# Altium project ethercat32.PrjPcb (part 2 of 3)

## Sheet DRV8300_CONTROLS.SchDoc
size B
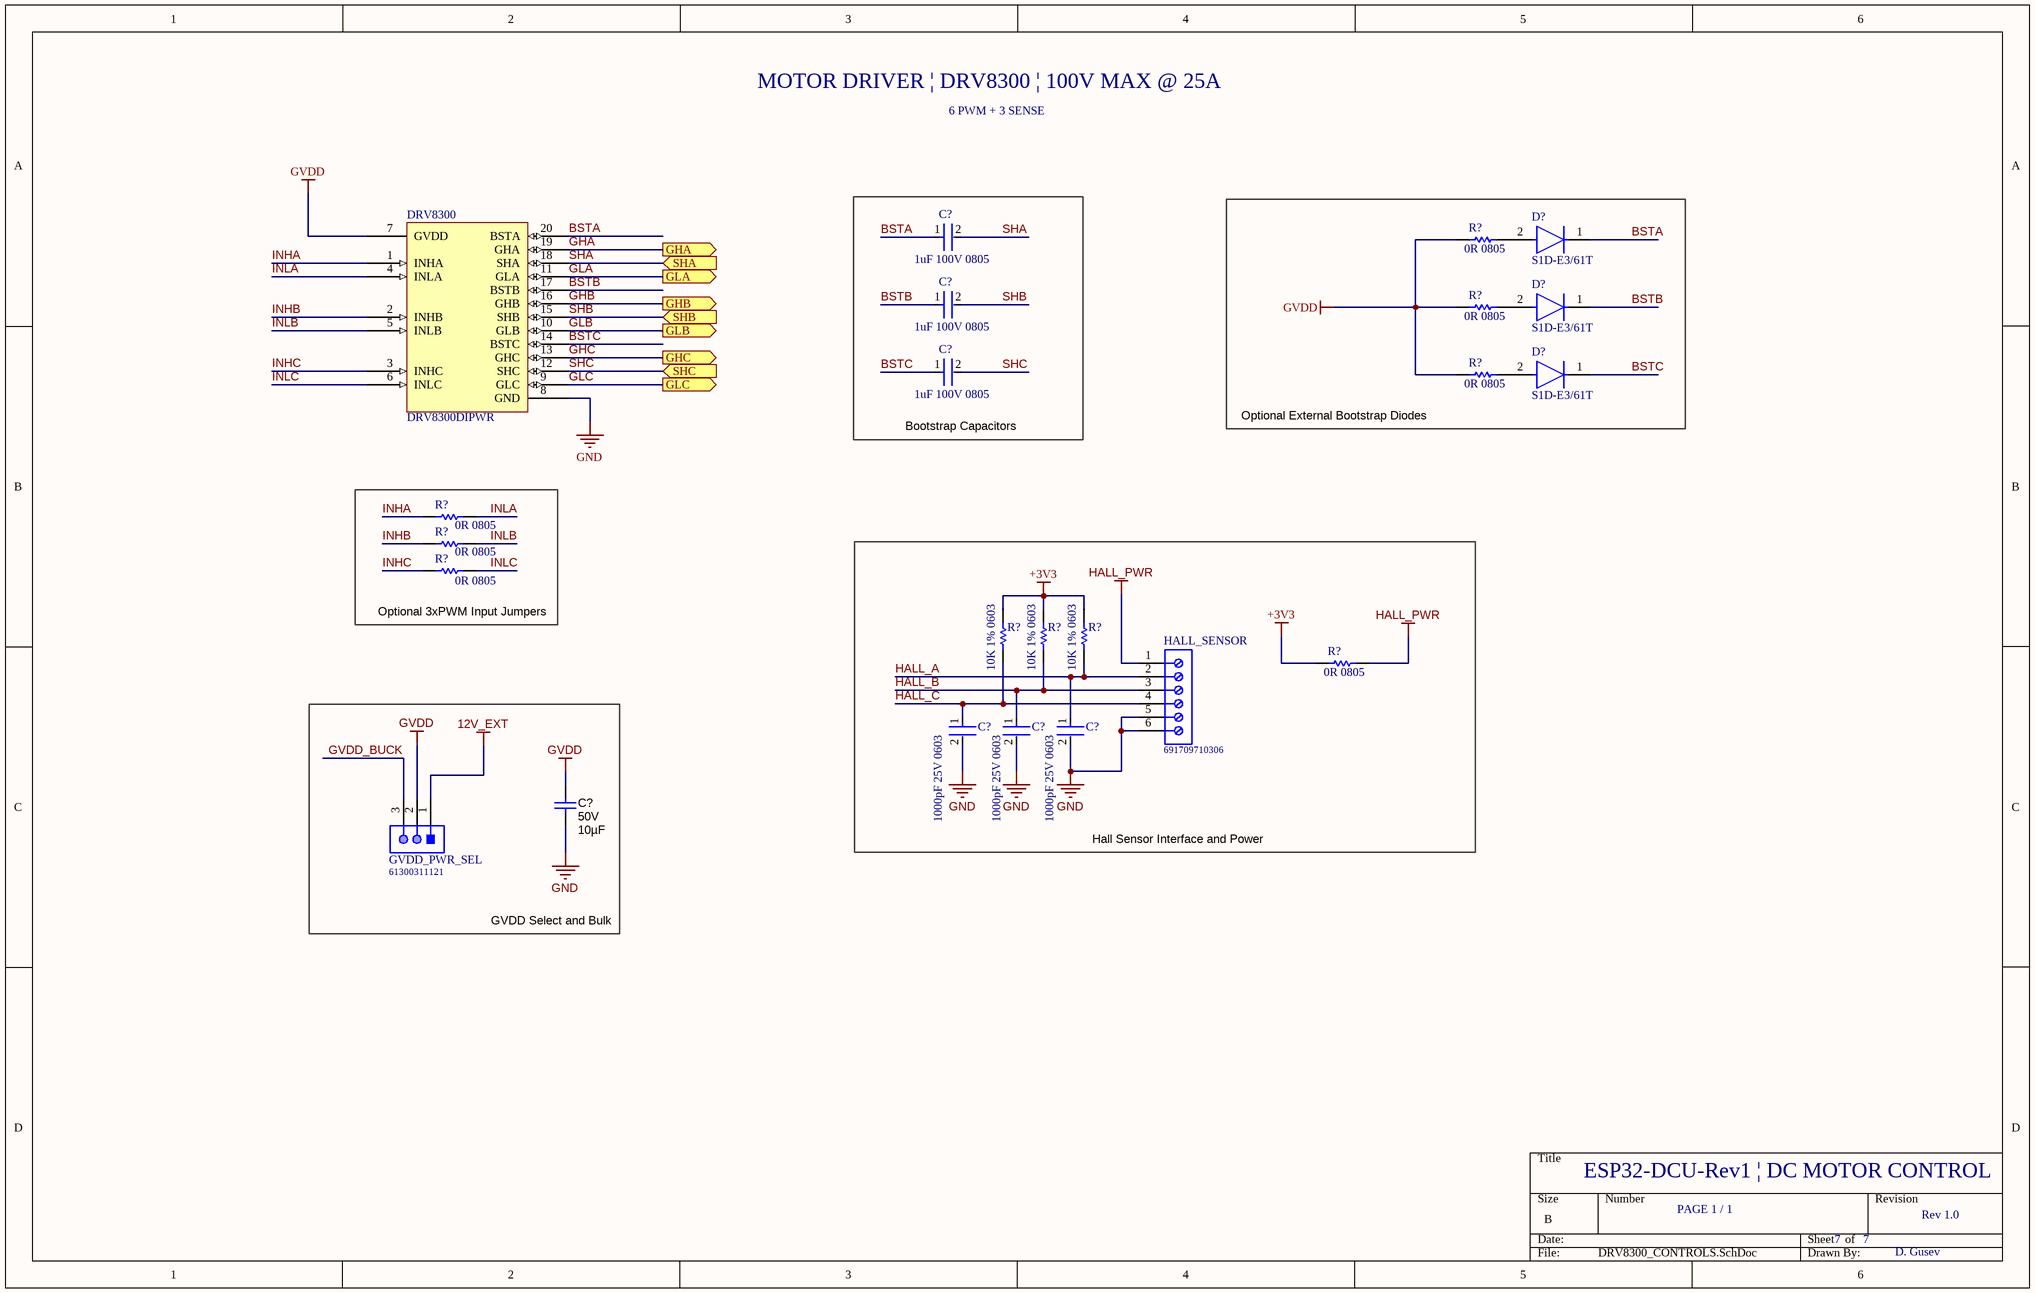
[diagram p5: DRV8300_CONTROLS.SchDoc]

### Parts
(Parts that share a designator on the sheet are numbered #1, #2 ... from top to bottom, then left to right.)
C?#1  1uF 100V 0805  [FP-C2012-125-0_2-IPC_A]
C?#2  1uF 100V 0805  [FP-C2012-125-0_2-IPC_A]
C?#3  1uF 100V 0805  [FP-C2012-125-0_2-IPC_A]
C?#4  1000pF 25V 0603  [FP-CC0201-BA-MFG]
C?#5  1000pF 25V 0603  [FP-CC0201-BA-MFG]
C?#6  1000pF 25V 0603  [FP-CC0201-BA-MFG]
C?#7  VDC_V: 50V  ValueDisplayed: 10µF  [1210_270L]  (hidden comment: CL32B106KBJNNWE)
D?#1  S1D-E3/61T  [FP-95400-MFG]
D?#2  S1D-E3/61T  [FP-95400-MFG]
D?#3  S1D-E3/61T  [FP-95400-MFG]
DRV8300  DRV8300DIPWR  [TSSOP_0DIPWR_TEX]
GVDD_PWR_SEL  61300311121  [61300311121]
HALL_SENSOR  691709710306  [691709710306]
R?#1  0R 0805  [RESC2013X60X35ML10T20]
R?#2  0R 0805  [RESC2013X60X35ML10T20]
R?#3  0R 0805  [RESC2013X60X35ML10T20]
R?#4  0R 0805  [RESC2013X60X35ML10T20]
R?#5  0R 0805  [RESC2013X60X35ML10T20]
R?#6  0R 0805  [RESC2013X60X35ML10T20]
R?#7  10K 1% 0603  [RESC2013X70X40ML20T20]
R?#8  10K 1% 0603  [RESC2013X70X40ML20T20]
R?#9  10K 1% 0603  [RESC2013X70X40ML20T20]
R?#10  0R 0805  [RESC2013X60X35ML10T20]

### Blocks framed on the sheet
Bootstrap Capacitors: C?#1-C?#3
Optional External Bootstrap Diodes: D?#1-D?#3 R?#1-R?#3
Optional 3xPWM Input Jumpers: R?#4-R?#6
Hall Sensor Interface and Power: C?#4-C?#6 HALL_SENSOR R?#7-R?#10
GVDD Select and Bulk: C?#7 GVDD_PWR_SEL

### Ports
GHA (out), GHB (out), GHC (out), GLA (out), GLB (out), GLC (out), SHA (in), SHB (in), SHC (in)

### Nets
12V_EXT: GVDD_PWR_SEL.1
+3V3: R?#7.1 R?#8.1 R?#9.1 R?#10.1
GND: C?#4.2 C?#5.2 C?#6.2 C?#7.2 DRV8300.8(GND) HALL_SENSOR.5 HALL_SENSOR.6
GVDD: C?#7.1 DRV8300.7(GVDD) GVDD_PWR_SEL.2 R?#1.1 R?#2.1 R?#3.1
HALL_PWR: HALL_SENSOR.1 R?#10.2
BSTA: C?#1.1 D?#1.1(C) DRV8300.20(BSTA)
BSTB: C?#2.1 D?#2.1(C) DRV8300.17(BSTB)
BSTC: C?#3.1 D?#3.1(C) DRV8300.14(BSTC)
GHA: DRV8300.19(GHA) ; port GHA
GHB: DRV8300.16(GHB) ; port GHB
GHC: DRV8300.13(GHC) ; port GHC
GLA: DRV8300.11(GLA) ; port GLA
GLB: DRV8300.10(GLB) ; port GLB
GLC: DRV8300.9(GLC) ; port GLC
GVDD_BUCK: GVDD_PWR_SEL.3
HALL_A: C?#6.1 HALL_SENSOR.2 R?#9.2
HALL_B: C?#5.1 HALL_SENSOR.3 R?#8.2
HALL_C: C?#4.1 HALL_SENSOR.4 R?#7.2
INHA: DRV8300.1(INHA) R?#4.1
INHB: DRV8300.2(INHB) R?#5.1
INHC: DRV8300.3(INHC) R?#6.1
INLA: DRV8300.4(INLA) R?#4.2
INLB: DRV8300.5(INLB) R?#5.2
INLC: DRV8300.6(INLC) R?#6.2
SHA: C?#1.2 DRV8300.18(SHA) ; port SHA
SHB: C?#2.2 DRV8300.15(SHB) ; port SHB
SHC: C?#3.2 DRV8300.12(SHC) ; port SHC
NetD?#1_2: D?#1.2(A) R?#1.2
NetD?#2_2: D?#2.2(A) R?#2.2
NetD?#3_2: D?#3.2(A) R?#3.2

### Notes on the sheet
- MOTOR DRIVER | DRV8300 | 100V MAX @ 25A
- 6 PWM + 3 SENSE
- ESP32-DCU-Rev1 | DC MOTOR CONTROL
- PAGE 1 / 1
- 7
- Rev 1.0
- D. Gusev

### Library data of the parts
C?#1-C?#3 = CMP-2000-05454-2: Multilayer Ceramic Capacitors 1μF ±10% 100V X7S SMD 0805; Case Code (Metric): 2012; Capacitance: 1uF; Width: 1.25mm; Mount: Surface Mount; Package Quantity: 1; RoHS Compliant: Yes; Case Code (Imperial): 0805; REACH SVHC: No SVHC; Resistor Type: Ceramic; Depth: 1.25mm; Dielectric: X7S; Thickness: 0.053inch; Case/Package: 0805; Lead Free: Lead Free; Length: 2mm; Series: C; Voltage Rating (DC): 100V; Voltage: 100V; Height: 1.25mm; Min Operating Temperature: -55°C; Termination: SMD/SMT; Weight: 0.000194oz; Max Operating Temperature: 125°C; Number of Pins: 2; Tolerance: 10%; Packaging: Tape and Reel; Voltage Rating: 100V
C?#4-C?#6 = CMP-03422-000456-1: CAP CER 1000PF 25V X7R 0201; Manufacturer Part Number: CC0201KRX7R8BB102; Manufacturer: Yageo; Description: CC0201 1.0 nF X7R 10.00% 25 V; Temperature Coefficient: 15%; Tolerance: 0.1; Capacitance: 1.0 nF; Value: 1.0 nF; Material: Ceramic; Footprint Url: http://www.yageo.com/exep/pages/download/literatures/UPY-C_GEN_24.pdf; Digikey Description: CAP CER 1000PF 25V X7R 0201; Voltage Rating: 25 V; ComponentLink2URL: http://www.yageo.com/documents/recent/UPY-GPHC_X5R_4V-to-50V_25.pdf; Lead Free: Yes; Temperature: -55°C to +85°C; Package: CC0201-BA; Automotive: No; Device Class L1: Passive Components; ComponentLink2Description: Datasheet; Octopart: https://octopart.com/cc0201krx7r8bb102-yageo-9292631; Temperature Range High: +85°C; Device Class L3: Ceramic Capacitors; Temperature Range Low: -55°C; Category: Cap; Device Class L2: Capacitors; Ipc Land Pattern Name: CAPC6030X30; Height: 0.33mm; Temperature Characteristic: X7R; RoHS: TRUE; Mouser Description: Multilayer Ceramic Capacitors MLCC - SMD/SMT 1.0nF 25V X7R 10%
C?#7 = CMP-0079201-1: CAP, CERM, 10 µF, 50 V,+/- 10%, X7R, 1210; Manufacturer: Samsung Electro-Mechanics; TaMin_C: -55°C; ESR_ohm: 5m; Polarized: N; SizeAreaWB_mm2: 14.7; Value1: 0.005 ohm; U/M: EA; Value: 10uF; TaMax_C: 125°C; SizeZ_mm: 2.7; SizeX_mm: 3.2; SizeY_mm: 2.5; Cap_Case: 1210; SizeArea_mm2: 8; AEC Category: Q200; ComponentLink1URL: http://www.samsungsem.com/kr/support/product-search/mlcc/__icsFiles/afieldfile/2016/08/18/S_CL32B106KBJNNWE.pdf; TempCo: X7R; RoHS: Y; MountType: SMT; Supplier 1: Digi-Key; PackageReference: 1210; Tolerance_%: 10%; Value2: 50V; CompType: Capacitor; PartNumber: CL32B106KBJNNWE; AEC Qualified: N; Cap_F: 10µF; ComponentLink1Description: Datasheet link; AEC Grade: N/A; Supplier Part Number 1: 1276-3388-1-ND; Technology: Ceramic
D?#1-D?#3 = CMP-02540-000033-1: DIODE GEN PURP 200V 1A DO214AC; Manufacturer: Vishay; Max Junction Temp: +150°C; Peak Reverse Current: 1uA; Standoff Height: 0mm; Max Surge Forward Current: 40A; Value: 12pF; Description: Diode Standard 200V 1A Surface Mount DO-214AC (SMA); Lead Free: Yes; Device Class L3: Rectifier Diodes; Package: 95400; Category: Diode; ComponentLink2URL: http://www.vishay.com/docs/88711/s1.pdf; Temperature: -55°C to +150°C; Mouser Description: S1B Series 1 A 200 V Surface Mount Glass Passivated Rectifier - DO-214AC; Digikey Description: DIODE GEN PURP 200V 1A DO214AC; Automotive: No; Forward Current: 1A; Device Class L1: Discrete Semiconductors; Max Repetitive Reverse Voltage: 200V; Manufacturer Part Number: S1D-E3/61T; Temperature Range High: +150°C; Octopart: https://octopart.com/s1d-e3%2F61t-vishay-39552129; ComponentLink2Description: Datasheet; Device Class L2: Diodes; RoHS: TRUE; Temperature Range Low: -55°C; Footprint Url: http://www.vishay.com/docs/95400/sma.pdf; Height: 2.29mm; Reverse Voltage: 200V; Capacitance: 12pF
DRV8300 = DRV8300DIPWR: No Description Available; Mfr_Name: Texas Instruments; Copyright: Copyright (C) 2022 Ultra Librarian. All rights reserved.; Manufacturer_Part_Number: DRV8300DIPWR; Digi-Key_Part_Number_1: 296-DRV8300DIPWRCT-ND; Digi-Key_Part_Number_2: 296-DRV8300DIPWRDKR-ND; Digi-Key_Part_Number_3: 296-DRV8300DIPWRTR-ND; RefDes: RefDes; Type: DEV
GVDD_PWR_SEL = CMP-1502-01062-1: THT Vertical Pin Header WR-PHD, Pitch 2.54 mm, Single Row, 3 pins; Manufacturer: Wurth Elektronik; Withstanding Voltage: 500VAC; Working Voltage: 250VAC; Rated Current: 3A; Pitch: 2.54mm; Pin Number: 3; Gender: Male; Contact Resistance: 20mOhm; Package Reference: 61300311121; Manufacturer URL: http://www.we-online.de; Datasheet URL: https://katalog.we-online.de/em/datasheet/6130xx11121.pdf; Operating Temperature: -40to105degC; Part Number: 61300311121; Orientation: Vertical; Packaging: Bag; Row Number: Single; Mounting Technology: THT; Publisher: WurthElektronik
HALL_SENSOR = CMP-1502-03339-1: Serie 7097 - 5.00 mm Horizontal Entry SMT with Pressure Clamp WR-TBL, 6 pin; Manufacturer: Wurth Elektronik; Pin Number: 6; Pitch: 5.00mm; Mounting Technology: SMT; Package Reference: 691709710306; Part Number: 691709710306; Publisher: WurthElektronik; Manufacturer URL: http://www.we-online.de; Operating Temperature: -45to130degC; Datasheet URL: http://katalog.we-online.de/em/datasheet/6917097103xx.pdf; Packaging: TapeandReelwithCap
R?#1-R?#6 R?#10 = CMP-2100-03673-1: Chip Resistor, 0 Ohm, Jumper, +/- 5%, 0.125 W, -55 to 155 degC, 0805 (2012 Metric), RoHS, Tape and Reel; Manufacturer: Yageo; Power Rating: 125mW; Resistance: 0mOhm; Voltage Rating (DC): 150V; Temperature Coefficient: 200ppm/degreesC; Height: 0.5mm; Depth: 1.25mm; Case Code (Imperial): 0805; Lead Free: LeadFree; Military Standard: Not; Package Description: 2-Pin Surface Mounted Device, Body 2 x 1.25 mm; Case Code (Metric): 2012; Composition: ThickFilm; Voltage Rating: 150V; Manufacturer URL: http://www.yageo.com/; Packaging: TapeandReel; Package Reference: 0805; REACH SVHC: Unknown; Tolerance: 5%; Case/Package: 0805; Max Operating Temperature: 155degC; Number of Pins: 2; Min Operating Temperature: -55degC; RoHSCompliant: true; Length: 2mm; Datasheet URL: http://www.yageo.com/NewPortal/yageodocoutput?fileName=/pdf/R-Chip/PYu-RC_Group_51_RoHS_L_5.pdf; Termination: SMD/SMT; Radiation Hardening: No; Width: 1.25mm; Contact Plating: Tin; Datasheet Version: Rev. 5, 10/2016
R?#7-R?#9 = CMP-2001-04376-1: Manufacturer: Panasonic; Part Number: ERJ-6ENF1002V

## Sheet DRV8300_GATES.SchDoc
size B
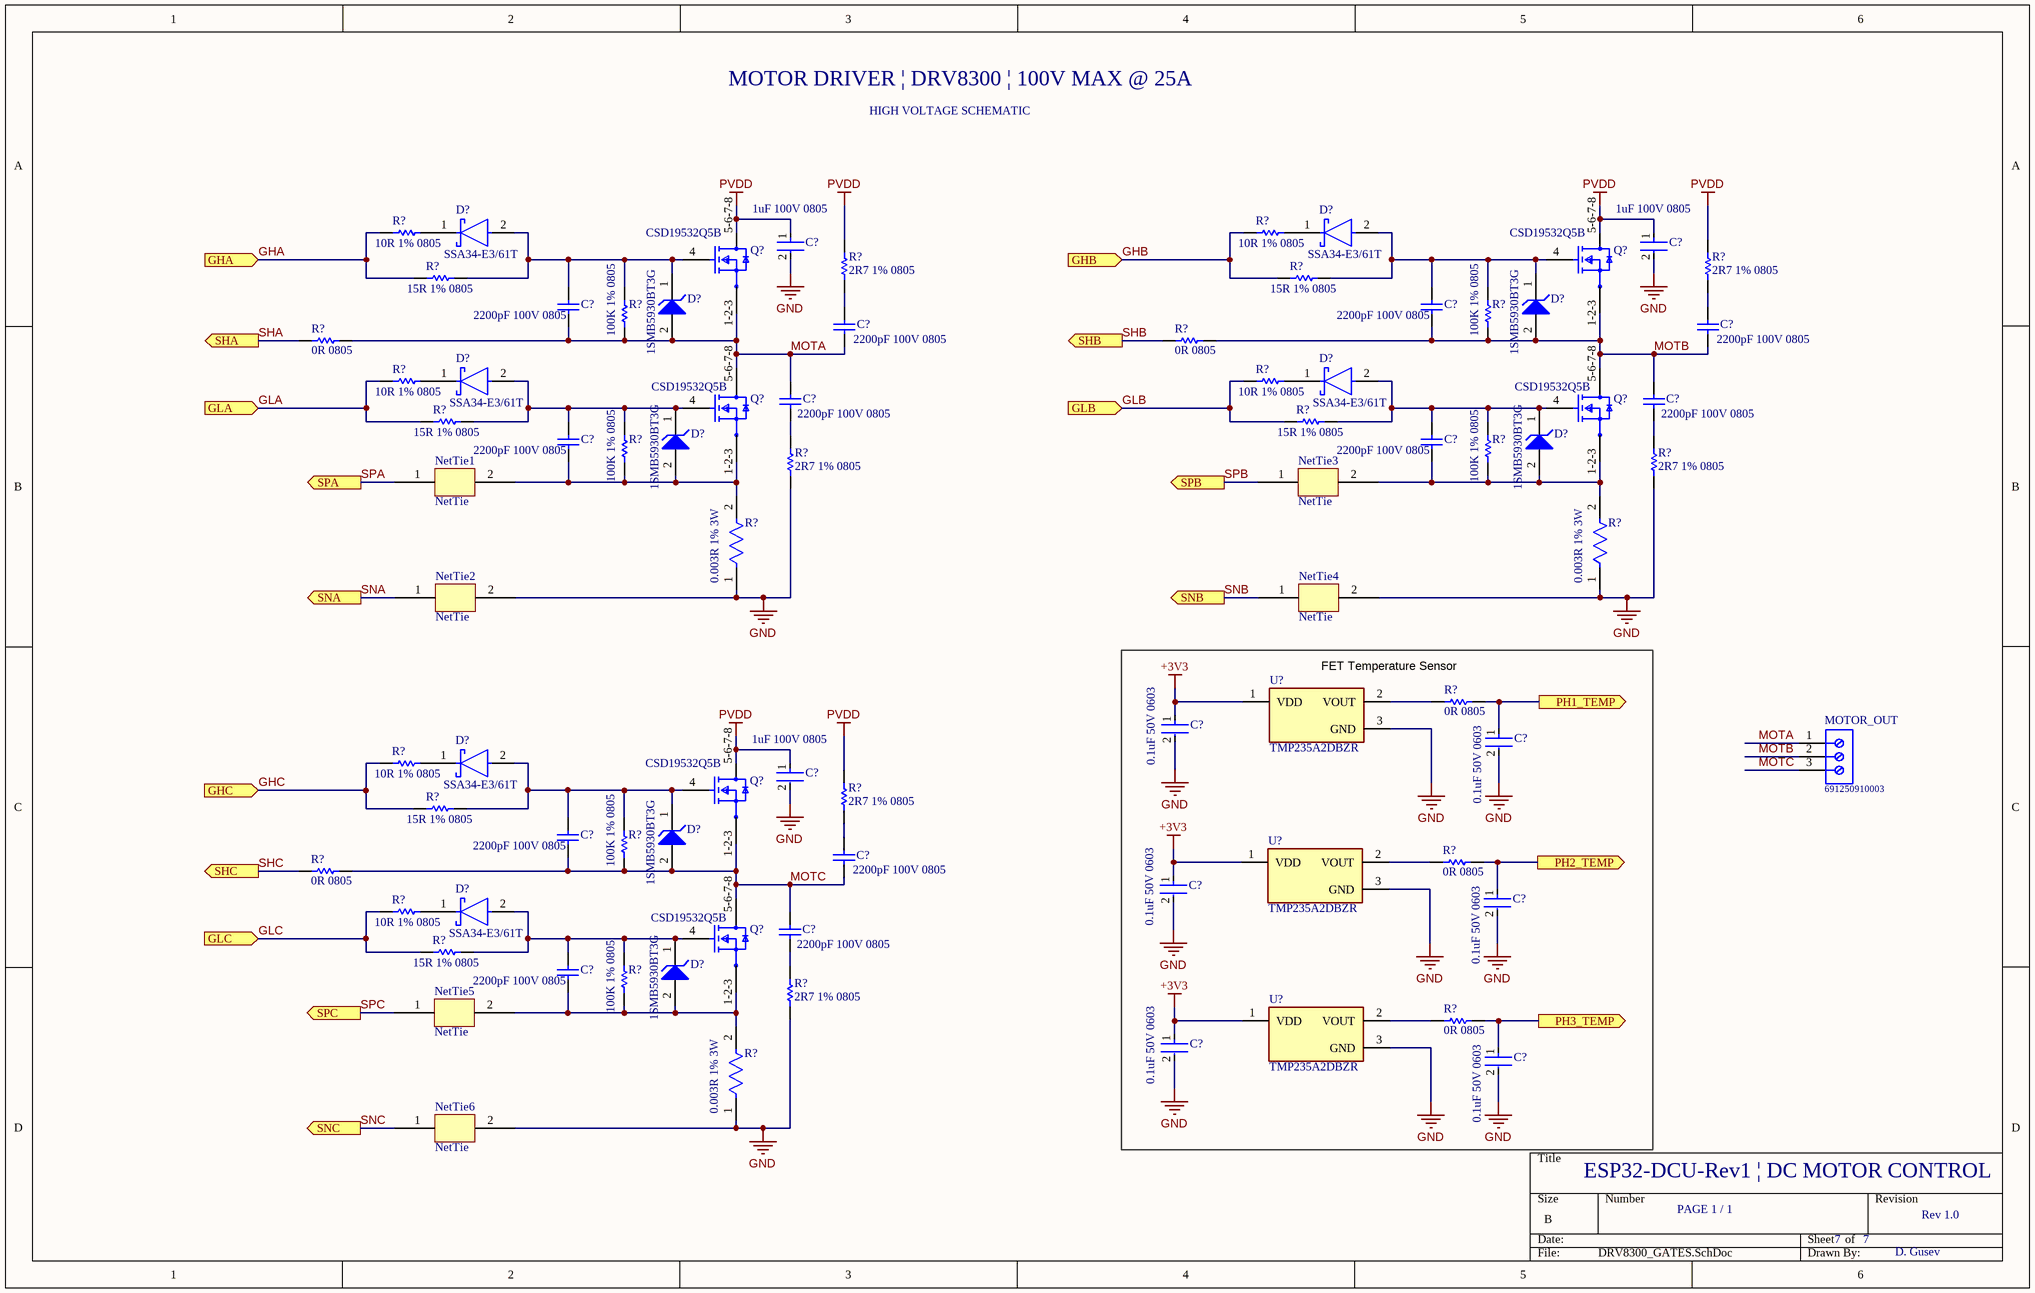
[diagram p6: DRV8300_GATES.SchDoc]

### Parts
(Parts that share a designator on the sheet are numbered #1, #2 ... from top to bottom, then left to right.)
C?#8  1uF 100V 0805  [FP-C2012-125-0_2-IPC_A]
C?#9  1uF 100V 0805  [FP-C2012-125-0_2-IPC_A]
C?#10  2200pF 100V 0805  [CAPC2013X94X50LL20T25]
C?#11  2200pF 100V 0805  [CAPC2013X94X50LL20T25]
C?#12  2200pF 100V 0805  [CAPC2013X94X50LL20T25]
C?#13  2200pF 100V 0805  [CAPC2013X94X50LL20T25]
C?#14  2200pF 100V 0805  [CAPC2013X94X50LL20T25]
C?#15  2200pF 100V 0805  [CAPC2013X94X50LL20T25]
C?#16  2200pF 100V 0805  [CAPC2013X94X50LL20T25]
C?#17  2200pF 100V 0805  [CAPC2013X94X50LL20T25]
C?#18  0.1uF 50V 0603  [FP-C0603C-CF-MFG]
C?#19  0.1uF 50V 0603  [FP-C0603C-CF-MFG]
C?#20  1uF 100V 0805  [FP-C2012-125-0_2-IPC_A]
C?#21  2200pF 100V 0805  [CAPC2013X94X50LL20T25]
C?#22  2200pF 100V 0805  [CAPC2013X94X50LL20T25]
C?#23  0.1uF 50V 0603  [FP-C0603C-CF-MFG]
C?#24  0.1uF 50V 0603  [FP-C0603C-CF-MFG]
C?#25  2200pF 100V 0805  [CAPC2013X94X50LL20T25]
C?#26  2200pF 100V 0805  [CAPC2013X94X50LL20T25]
C?#27  0.1uF 50V 0603  [FP-C0603C-CF-MFG]
C?#28  0.1uF 50V 0603  [FP-C0603C-CF-MFG]
D?#4  SSA34-E3/61T  [FP-95400-MFG]
D?#5  SSA34-E3/61T  [FP-95400-MFG]
D?#6  1SMB5930BT3G  [ONSC-SMB-2-403A-03_H_V]
D?#7  1SMB5930BT3G  [ONSC-SMB-2-403A-03_H_V]
D?#8  SSA34-E3/61T  [FP-95400-MFG]
D?#9  SSA34-E3/61T  [FP-95400-MFG]
D?#10  1SMB5930BT3G  [ONSC-SMB-2-403A-03_H_V]
D?#11  1SMB5930BT3G  [ONSC-SMB-2-403A-03_H_V]
D?#12  SSA34-E3/61T  [FP-95400-MFG]
D?#13  1SMB5930BT3G  [ONSC-SMB-2-403A-03_H_V]
D?#14  SSA34-E3/61T  [FP-95400-MFG]
D?#15  1SMB5930BT3G  [ONSC-SMB-2-403A-03_H_V]
MOTOR_OUT  691250910003  [691250910003]
NetTie1  NetTie  [NetTie]
NetTie2  NetTie  [NetTie]
NetTie3  NetTie  [NetTie]
NetTie4  NetTie  [NetTie]
NetTie5  NetTie  [NetTie]
NetTie6  NetTie  [NetTie]
Q?#1  CSD19532Q5B  [CSD19532Q5B]
Q?#2  CSD19532Q5B  [CSD19532Q5B]
Q?#3  CSD19532Q5B  [CSD19532Q5B]
Q?#4  CSD19532Q5B  [CSD19532Q5B]
Q?#5  CSD19532Q5B  [CSD19532Q5B]
Q?#6  CSD19532Q5B  [CSD19532Q5B]
R?#11  10R 1% 0805  [RESC2013X60X35ML10T20]
R?#12  10R 1% 0805  [RESC2013X60X35ML10T20]
R?#13  15R 1% 0805  [RESC2013X70X40NL20T20]
R?#14  15R 1% 0805  [RESC2013X70X40NL20T20]
R?#15  2R7 1% 0805  [RESC2013X70X40NL20T20]
R?#16  2R7 1% 0805  [RESC2013X70X40NL20T20]
R?#17  100K 1% 0805  [RESC2013X60X35ML10T20]
R?#18  100K 1% 0805  [RESC2013X60X35ML10T20]
R?#19  0R 0805  [RESC2013X60X35ML10T20]
R?#20  0R 0805  [RESC2013X60X35ML10T20]
R?#21  10R 1% 0805  [RESC2013X60X35ML10T20]
R?#22  10R 1% 0805  [RESC2013X60X35ML10T20]
R?#23  15R 1% 0805  [RESC2013X70X40NL20T20]
R?#24  15R 1% 0805  [RESC2013X70X40NL20T20]
R?#25  100K 1% 0805  [RESC2013X60X35ML10T20]
R?#26  100K 1% 0805  [RESC2013X60X35ML10T20]
R?#27  2R7 1% 0805  [RESC2013X70X40NL20T20]
R?#28  2R7 1% 0805  [RESC2013X70X40NL20T20]
R?#29  0.003R 1% 3W  [FP-CSR1225-IPC_C]
R?#30  0.003R 1% 3W  [FP-CSR1225-IPC_C]
R?#31  0R 0805  [RESC2013X60X35ML10T20]
R?#32  10R 1% 0805  [RESC2013X60X35ML10T20]
R?#33  15R 1% 0805  [RESC2013X70X40NL20T20]
R?#34  2R7 1% 0805  [RESC2013X70X40NL20T20]
R?#35  100K 1% 0805  [RESC2013X60X35ML10T20]
R?#36  0R 0805  [RESC2013X60X35ML10T20]
R?#37  0R 0805  [RESC2013X60X35ML10T20]
R?#38  10R 1% 0805  [RESC2013X60X35ML10T20]
R?#39  15R 1% 0805  [RESC2013X70X40NL20T20]
R?#40  100K 1% 0805  [RESC2013X60X35ML10T20]
R?#41  2R7 1% 0805  [RESC2013X70X40NL20T20]
R?#42  0R 0805  [RESC2013X60X35ML10T20]
R?#43  0.003R 1% 3W  [FP-CSR1225-IPC_C]
U?#1  TMP235A2DBZR  [FP-DBZ0003A-MFG]
U?#2  TMP235A2DBZR  [FP-DBZ0003A-MFG]
U?#3  TMP235A2DBZR  [FP-DBZ0003A-MFG]

### Blocks framed on the sheet
FET Temperature Sensor: C?#18 C?#19 C?#23 C?#24 C?#27 C?#28 R?#31 R?#36 R?#42 U?#1-U?#3

### Ports
GHA (in), GHB (in), GHC (in), GLA (in), GLB (in), GLC (in), PH1_TEMP (out), PH2_TEMP (out), PH3_TEMP (out), SHA (out), SHB (out), SHC (out), SNA (out), SNB (out), SNC (out), SPA (out), SPB (out), SPC (out)

### Nets
+3V3: C?#18.1 C?#23.1 C?#27.1 U?#1.1(VDD) U?#2.1(VDD) U?#3.1(VDD)
GND: C?#8.2 C?#9.2 C?#18.2 C?#19.2 C?#20.2 C?#23.2 C?#24.2 C?#27.2 C?#28.2 NetTie2.2 NetTie4.2 NetTie6.2 R?#27.1 R?#28.1 R?#29.1 R?#30.1 R?#41.1 R?#43.1 U?#1.3(GND) U?#2.3(GND) U?#3.3(GND)
PVDD: C?#8.1 C?#9.1 C?#20.1 Q?#1.5-6-7-8(D) Q?#2.5-6-7-8(D) Q?#5.5-6-7-8(D) R?#15.2 R?#16.2 R?#34.2
GHA: R?#11.1 R?#13.1 ; port GHA
GHB: R?#12.1 R?#14.1 ; port GHB
GHC: R?#32.1 R?#33.1 ; port GHC
GLA: R?#21.1 R?#23.1 ; port GLA
GLB: R?#22.1 R?#24.1 ; port GLB
GLC: R?#38.1 R?#39.1 ; port GLC
MOTA: C?#10.1 C?#12.1 C?#14.2 D?#6.2(A) MOTOR_OUT.1 Q?#1.1-2-3(S) Q?#3.5-6-7-8(D) R?#17.1 R?#19.2
MOTB: C?#11.1 C?#13.1 C?#15.2 D?#7.2(A) MOTOR_OUT.2 Q?#2.1-2-3(S) Q?#4.5-6-7-8(D) R?#18.1 R?#20.2
MOTC: C?#21.1 C?#22.1 C?#25.2 D?#13.2(A) MOTOR_OUT.3 Q?#5.1-2-3(S) Q?#6.5-6-7-8(D) R?#35.1 R?#37.2
SHA: R?#19.1 ; port SHA
SHB: R?#20.1 ; port SHB
SHC: R?#37.1 ; port SHC
SNA: NetTie2.1 ; port SNA
SNB: NetTie4.1 ; port SNB
SNC: NetTie6.1 ; port SNC
SPA: NetTie1.1 ; port SPA
SPB: NetTie3.1 ; port SPB
SPC: NetTie5.1 ; port SPC
NetC?#10_2: C?#10.2 D?#4.2(A) D?#6.1(K) Q?#1.4(G) R?#13.2 R?#17.2
NetC?#11_2: C?#11.2 D?#5.2(A) D?#7.1(K) Q?#2.4(G) R?#14.2 R?#18.2
NetC?#12_2: C?#12.2 R?#15.1
NetC?#13_2: C?#13.2 R?#16.1
NetC?#14_1: C?#14.1 R?#27.2
NetC?#15_1: C?#15.1 R?#28.2
NetC?#16_1: C?#16.1 D?#10.2(A) NetTie1.2 Q?#3.1-2-3(S) R?#25.1 R?#29.2
NetC?#16_2: C?#16.2 D?#8.2(A) D?#10.1(K) Q?#3.4(G) R?#23.2 R?#25.2
NetC?#17_1: C?#17.1 D?#11.2(A) NetTie3.2 Q?#4.1-2-3(S) R?#26.1 R?#30.2
NetC?#17_2: C?#17.2 D?#9.2(A) D?#11.1(K) Q?#4.4(G) R?#24.2 R?#26.2
NetC?#19_1: C?#19.1 R?#31.2 ; port PH1_TEMP
NetC?#21_2: C?#21.2 D?#12.2(A) D?#13.1(K) Q?#5.4(G) R?#33.2 R?#35.2
NetC?#22_2: C?#22.2 R?#34.1
NetC?#24_1: C?#24.1 R?#36.2 ; port PH2_TEMP
NetC?#25_1: C?#25.1 R?#41.2
NetC?#26_1: C?#26.1 D?#15.2(A) NetTie5.2 Q?#6.1-2-3(S) R?#40.1 R?#43.2
NetC?#26_2: C?#26.2 D?#14.2(A) D?#15.1(K) Q?#6.4(G) R?#39.2 R?#40.2
NetC?#28_1: C?#28.1 R?#42.2 ; port PH3_TEMP
NetD?#4_1: D?#4.1(C) R?#11.2
NetD?#5_1: D?#5.1(C) R?#12.2
NetD?#8_1: D?#8.1(C) R?#21.2
NetD?#9_1: D?#9.1(C) R?#22.2
NetD?#12_1: D?#12.1(C) R?#32.2
NetD?#14_1: D?#14.1(C) R?#38.2
NetR?#31_1: R?#31.1 U?#1.2(VOUT)
NetR?#36_1: R?#36.1 U?#2.2(VOUT)
NetR?#42_1: R?#42.1 U?#3.2(VOUT)

### Notes on the sheet
- MOTOR DRIVER | DRV8300 | 100V MAX @ 25A
- HIGH VOLTAGE SCHEMATIC
- ESP32-DCU-Rev1 | DC MOTOR CONTROL
- PAGE 1 / 1
- 7
- Rev 1.0
- D. Gusev

### Library data of the parts
C?#8 C?#9 C?#20 = CMP-2000-05454-2: as C?#1 on sheet DRV8300_CONTROLS; Case Code (Metric): 2012; Capacitance: 1uF; Width: 1.25mm; Mount: Surface Mount; Package Quantity: 1; RoHS Compliant: Yes; Case Code (Imperial): 0805; REACH SVHC: No SVHC; Resistor Type: Ceramic; Depth: 1.25mm; Dielectric: X7S; Thickness: 0.053inch; Case/Package: 0805; Lead Free: Lead Free; Length: 2mm; Series: C; Voltage Rating (DC): 100V; Voltage: 100V; Height: 1.25mm; Min Operating Temperature: -55°C; Termination: SMD/SMT; Weight: 0.000194oz; Max Operating Temperature: 125°C; Number of Pins: 2; Tolerance: 10%; Packaging: Tape and Reel; Voltage Rating: 100V
C?#10-C?#17 C?#21 C?#22 C?#25 C?#26 = CMP-2007-04184-1: Part Number: 08051C222JAT2A; Manufacturer: AVX Interconnect / Elco
C?#18 C?#19 C?#23 C?#24 C?#27 C?#28 = CMP-2006-03061-2: CAP CER 0.1UF 50V X7R 0603; Manufacturer: KEMET; Manufacturer Part Number: C0603C104K5RACTU; Tolerance: 0.1; Description: C0603 0.10 μF X7R 30ppm/°C 10.00% 50 V; Temperature Coefficient: 30ppm/°C; Material: Ceramic; Automotive Grade: Grade 1; Value: 0.10 μF; Temperature: -55°C to +125°C; RoHS: TRUE; Temperature Range High: +125°C; Lead Free: Yes; Octopart: https://octopart.com/c0603c104k5ractu-kemet-139244; Digikey Description: CAP CER 0.1UF 50V X7R 0603; Category: Cap; Package: C0603C-CF; ComponentLink2Description: Datasheet; Temperature Range Low: -55°C; Device Class L1: Passive Components; Voltage Rating: 50 V; Automotive: Yes; Device Class L3: Ceramic Capacitors; ComponentLink2URL: https://api.kemet.com/component-edge/download/datasheet/C0603C100J5GACAUTO.pdf; Capacitance: 0.10 μF; Device Class L2: Capacitors; Temperature Characteristic: X7R; Height: 0.87mm
D?#4 D?#5 D?#8 D?#9 D?#12 D?#14 = CMP-02539-000022-2: DIODE SCHOTTKY 40V 3A DO214AC; Element Configuration: Single; Max Reverse Leakage Current: 200uA; Polarity: Standard; Peak Non-Repetitive Surge Current: 75A; Forward Voltage: 490mV; Radiation Hardening: No; Current Rating: 3A; Contact Plating: Tin; Output Current: 3A; Height: 2.087mm; Mount: Surface Mount; Case/Package: SMA; Packaging: Tape and Reel; Width: 2.79mm; Average Rectified Current: 3A; Max Repetitive Reverse Voltage (Vrrm): 40V; Max Operating Temperature: 150°C; Length: 4.5mm; RoHS Compliant: Yes; Max Reverse Current: 200uA; Voltage Rating (DC): 40V; Min Operating Temperature: -65°C; Max Reverse Voltage (DC): 40V; Number of Pins: 2; Max Forward Surge Current (Ifsm): 75A; Lead Free: Lead Free; Forward Current: 3A; Max Surge Current: 75A; Package Quantity: 1
D?#6 D?#7 D?#10 D?#11 D?#13 D?#15 = CMP-1060-00159-1: 3 W Zener Voltage Regulator, 2-Pin SMB, Pb-Free, Tape and Reel; Manufacturer: On Semiconductor; VZ Typ (V): 16; PackageReference: SMB-2-403A-03_H; Mounting Technology: Surface Mount; RoHS: Pb-Free; PackageVersion: Rev. H, 05/2011; ComponentLink2URL: http://www.onsemi.com/pub_link/Collateral/1SMB5913BT3-D.PDF; PartNumber: 1SMB5930BT3G; ComponentLink2Description: Datasheet; ComponentLink1Description: Manufacturer URL; ComponentLink1URL: http://www.onsemi.com/; DatasheetVersion: Rev. 8; Packing: Tape and Reel; PackageDescription: 2-Pin Small Molded Package, J-Bend Lead, Body 4.33 x 3.625 mm; ComponentLink3URL: http://www.onsemi.com/pub_link/Collateral/1SMB5913BT3-D.PDF; ComponentLink3Description: Package Specification
MOTOR_OUT = CMP-1502-02751-1: Serie 2509 - 9.52 mm Horizontal Entry Modular with Rising Cage Clamp WR-TBL, 3 pin; Manufacturer: Wurth Elektronik; Pin Number: 3; Pitch: 9.52mm; Publisher: WurthElektronik; Mounting Technology: THT; Packaging: Box; Part Number: 691250910003; Manufacturer URL: http://www.we-online.de; Operating Temperature: -30to120degC; Datasheet URL: http://katalog.we-online.de/em/datasheet/6912509100XX.pdf; Package Reference: 691250910003
NetTie1-NetTie6 = NetTie: Connection between two nets
Q?#1-Q?#6 = CSD19532Q5B: MOSFET N-CH 100V 100A 8SON; Manufacturer: Texas Instruments; Depletion Mode: False; Number Of Channels: 1; Gate To Source Voltage: 20V; Reverse Recovery Time: 80ns; Input Capacitace At Vds: 3700pF @ 50V; Max Forward Diode Voltage: 1V; Turn Off Delay Time: 22ns; Drain To Source Resistance: 4.6mΩ; Threshold Vgs Max: 3.2V; Max Junction Temp: +150°C; Turn On Delay Time: 7ns; Pulse Drain Current: 400A; Rthja Max: 50°C/W; Typ Forward Diode Voltage: 0.8V; Reverse Recovery Charge: 249nC; Threshold Vgs Min: 2.2V; Gate Charge At Vgs: 48nC @ 10V; Power Dissipation: 3.1W; Transconductance: 84S; Temperature Range Low: -55°C; Automotive: No; RoHS: TRUE; Temperature: -55°C to +150°C; Device Class L3: MOSFETs; Continuous Drain Current: 100A; Number Of N Channels: 1; Height: 1.05mm; Mouser Description: MOSFET 100V 4.0 mOhm N-Ch NexFET Power MOSFET; Drain To Source Voltage: 100V; Temperature Range High: +150°C; Manufacturer Part Number: CSD19532Q5B; Octopart: https://octopart.com/csd19532q5b-texas+instruments-32890191; ComponentLink2URL: http://www.ti.com/lit/ds/symlink/csd19532q5b.pdf; Lead Free: Yes; Drain To Source Breakdown Voltage: 100V; Device Class L1: Discrete Semiconductors; Device Class L2: Transistors; Package: DNK0008A; Digikey Description: MOSFET N-CH 100V 100A 8SON; Category: Trans; ComponentLink2Description: Datasheet
R?#11 R?#12 R?#21 R?#22 R?#32 R?#38 = CMP-2100-03670-1: Chip Resistor, 10 Ohm, +/- 1%, 0.125 W, -55 to 155 degC, 0805 (2012 Metric), RoHS, Tape and Reel; Manufacturer: Yageo; Resistance: 10Ohm; Power Rating: 125mW; Voltage Rating: 150V; Temperature Coefficient: 200ppm/degreesC; Number of Pins: 2; REACH SVHC: NoSVHC; Datasheet Version: Rev. 5, 10/2016; Max Operating Temperature: 155degC; Manufacturer URL: http://www.yageo.com/; Case Code (Imperial): 0805; Package Description: 2-Pin Surface Mounted Device, Body 2 x 1.25 mm; Case Code (Metric): 2012; Length: 2mm; RoHSCompliant: true; Max Power Dissipation: 125mW; Depth: 1.25mm; Packaging: TapeandReel; Height: 0.5mm; Package Reference: 0805; Package Quantity: 1; Tolerance: 1%; Termination: SMD/SMT; Min Operating Temperature: -55degC; Lead Free: LeadFree; Width: 1.25mm; Voltage Rating (DC): 150V; Datasheet URL: http://www.yageo.com/NewPortal/yageodocoutput?fileName=/pdf/R-Chip/PYu-RC_Group_51_RoHS_L_5.pdf; Composition: ThickFilm; Number of Terminations: 2; Case/Package: 0805
R?#13 R?#14 R?#23 R?#24 R?#33 R?#39 = CMP-1013-00302-2: Part Number: ERJ-6ENF15R0V; Manufacturer: Panasonic
R?#15 R?#16 R?#27 R?#28 R?#34 R?#41 = CMP-2001-00461-1: Part Number: ERJ-6RQF2R7V; Manufacturer: Panasonic
R?#17 R?#18 R?#25 R?#26 R?#35 R?#40 = CMP-2100-03668-1: Chip Resistor, 100 KOhm, +/- 1%, 0.125 W, -55 to 155 degC, 0805 (2012 Metric), RoHS, Tape and Reel; Manufacturer: Yageo; Max Power Dissipation: 125mW; Voltage Rating: 150V; Temperature Coefficient: 100ppm/degreesC; Manufacturer URL: http://www.yageo.com/; Min Operating Temperature: -55degC; Lead Pitch: 0.4mm; Composition: ThickFilm; Case Code (Metric): 2012; Military Standard: Not; Package Description: 2-Pin Surface Mounted Device, Body 2 x 1.25 mm; REACH SVHC: Unknown; RoHSCompliant: true; Depth: 1.25mm; Number of Pins: 2; Lead Free: LeadFree; Resistance: 100KOhm; Datasheet URL: http://www.yageo.com/NewPortal/yageodocoutput?fileName=/pdf/R-Chip/PYu-RC_Group_51_RoHS_L_5.pdf; Max Operating Temperature: 155degC; Case/Package: 0805; Package Quantity: 1; Case Code (Imperial): 0805; Power Rating: 125mW; Width: 0.049inch; Package Reference: 0805; Height: 0.024inch; Termination: SMD/SMT; Tolerance: 1%; Datasheet Version: Rev. 5, 10/2016; Length: 2mm; Voltage Rating (DC): 150V; Number of Terminations: 2; Packaging: TapeandReel
R?#19 R?#20 R?#31 R?#36 R?#37 R?#42 = CMP-2100-03673-1: as R?#1 on sheet DRV8300_CONTROLS; Height: 0.5mm; Depth: 1.25mm; Case Code (Imperial): 0805; Lead Free: LeadFree; Military Standard: Not; Package Description: 2-Pin Surface Mounted Device, Body 2 x 1.25 mm; Case Code (Metric): 2012; Composition: ThickFilm; Voltage Rating: 150V; Manufacturer URL: http://www.yageo.com/; Packaging: TapeandReel; Package Reference: 0805; REACH SVHC: Unknown; Tolerance: 5%; Case/Package: 0805; Max Operating Temperature: 155degC; Number of Pins: 2; Min Operating Temperature: -55degC; RoHSCompliant: true; Length: 2mm; Datasheet URL: http://www.yageo.com/NewPortal/yageodocoutput?fileName=/pdf/R-Chip/PYu-RC_Group_51_RoHS_L_5.pdf; Termination: SMD/SMT; Radiation Hardening: No; Width: 1.25mm; Contact Plating: Tin; Datasheet Version: Rev. 5, 10/2016
R?#29 R?#30 R?#43 = CMP-26527-005975-1: General Purpose Thick Film Chip Resistor, 1225, 3mΩ, 1%, 200ppm/°C, 3W; Resistance: 3mR; Min Operating Temperature: -55°C; Max Operating Temperature: 155°C; Power Rating: 3W; Lead Free: Lead Free; Resistor Type: Thick Film; RoHS Compliant: Yes; Case/Package: 1225; Contact Plating: Tin; Mount: Surface Mount; Temperature Coefficient: 200ppm/°C; Packaging: Tape and Reel; Tolerance: 1%; Radiation Hardening: No
U?#1-U?#3 = CMP-04948-000003-1: LOW-POWER HIGH-ACCURACY ANALOG O; Manufacturer: Texas Instruments; Output Current: 500uA; Operating Supply Current: 9uA; Max Supply Voltage: 5.5V; Max Junction Temp: +150°C; Accuracy: 0.5%; Min Supply Voltage: 2.3V; Standoff Height: 0.01mm; Sensor Output: Analog Voltage; Description: Temperature Sensor Analog, Local -40°C ~ 150°C 10mV/°C SOT-23-3; Ambient Temperature Range Low: -40°C; Device Class L2: Temperature and Humidity Sensors; Digikey Description: LOW-POWER HIGH-ACCURACY ANALOG O; Lead Free: Yes; Category: IC; Device Class L3: unset; Temperature Range Low: -40°C; Manufacturer Part Number: TMP235A2DBZR; ComponentLink2Description: Datasheet; Package: DBZ0003A; Octopart: https://octopart.com/tmp235a2dbzr-texas+instruments-94966376; Device Class L1: Sensors; Temperature Range High: +150°C; Height: 1.12mm; Temperature: -40°C to +150°C; RoHS: TRUE; Ambient Temperature Range High: +150°C; Automotive: No; ComponentLink2URL: http://www.ti.com/lit/ds/symlink/tmp235.pdf; Mouser Description: ±2°C Analog output temperature sensor, with 10mV /°C gain 3-SOT-23 -40 to 150

## Sheet DRV8300_FEEDBACK.SchDoc
size B
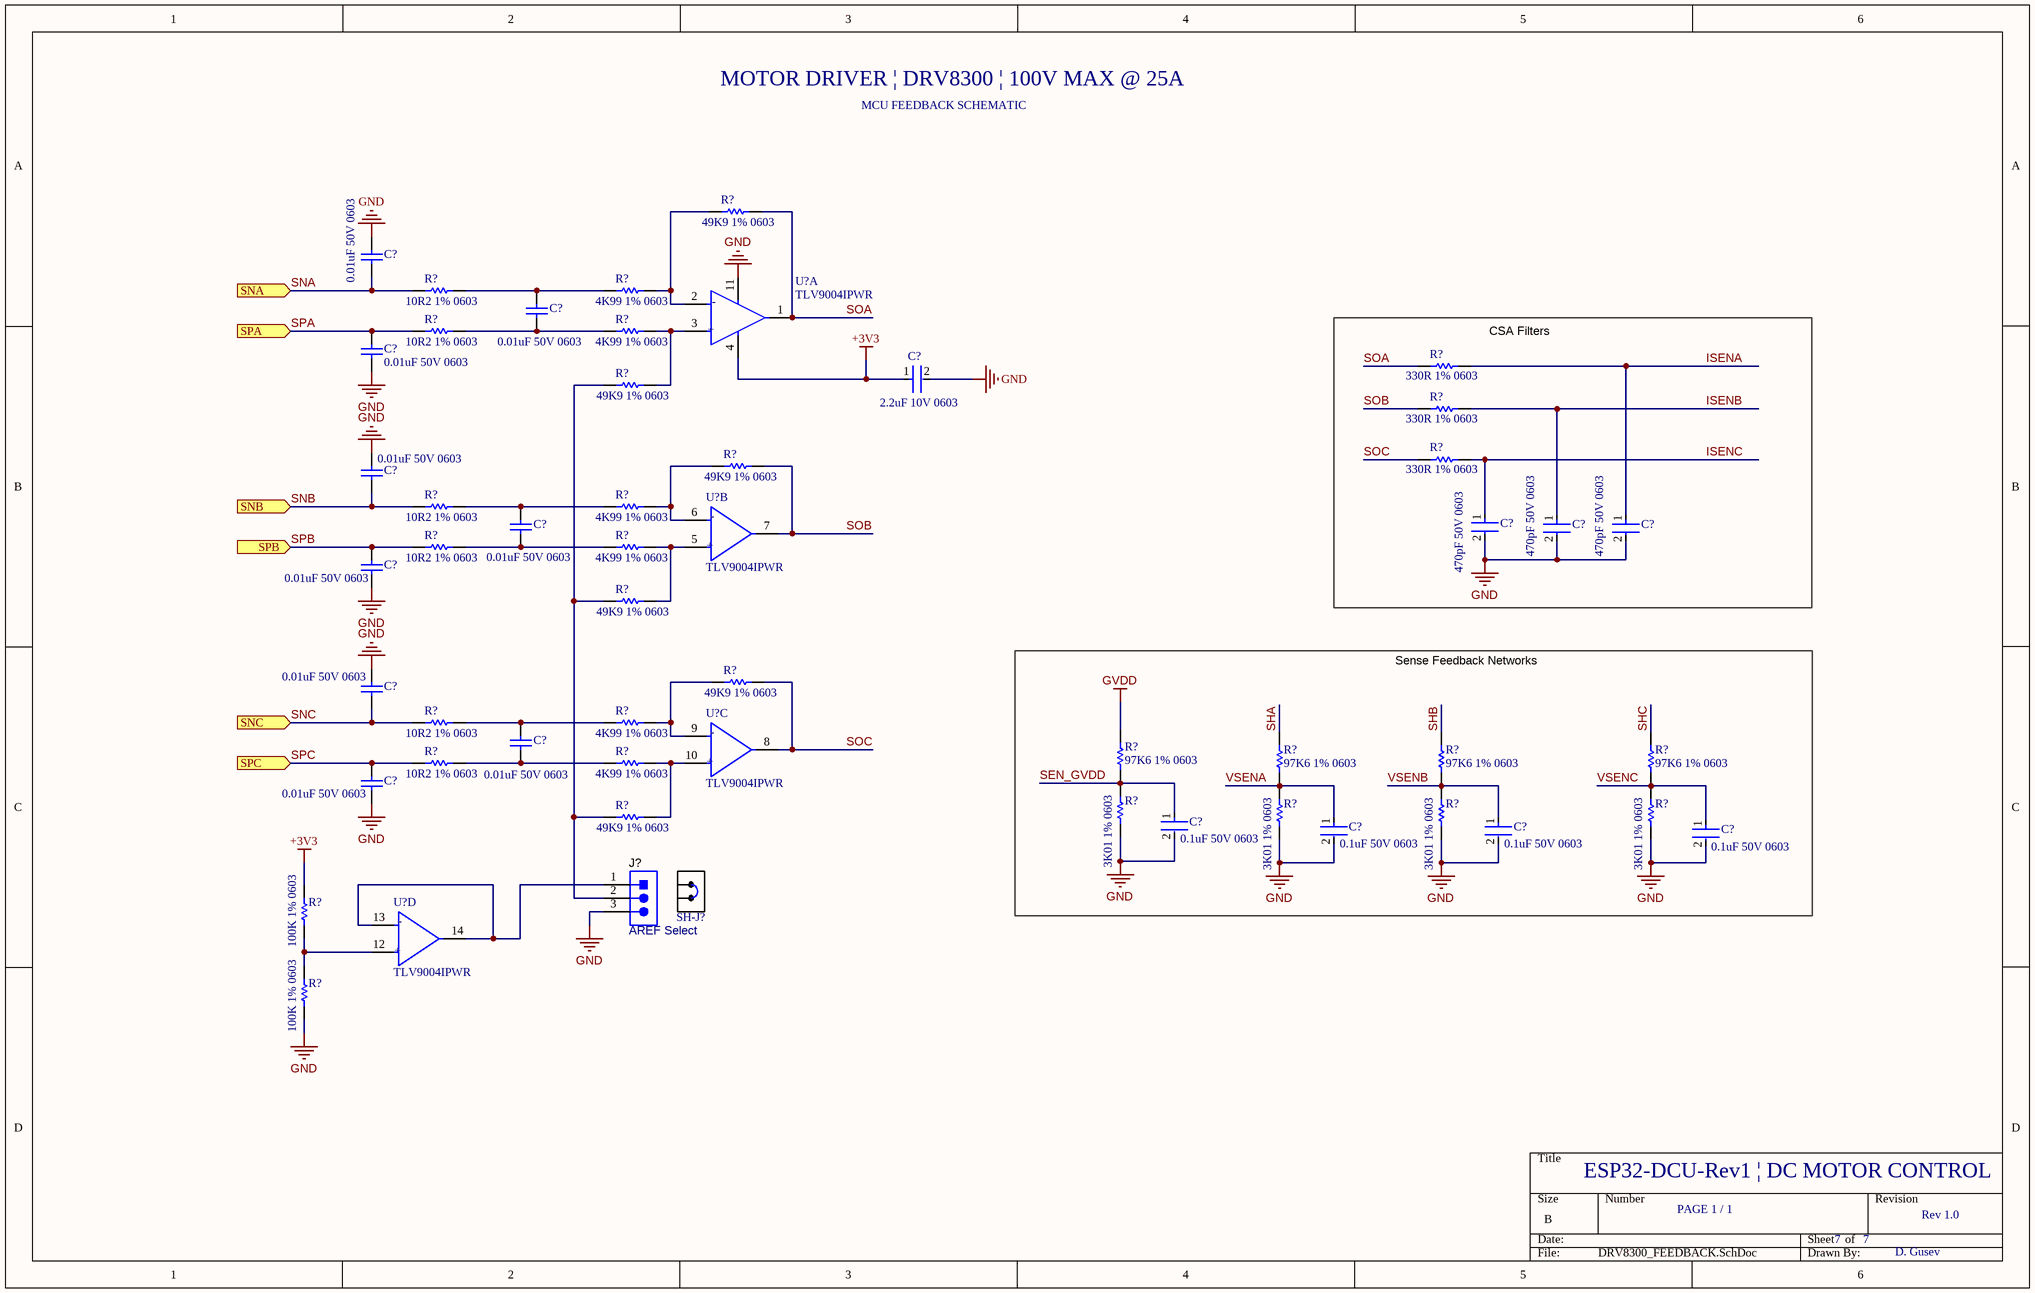
[diagram p7: DRV8300_FEEDBACK.SchDoc]

### Parts
(Parts that share a designator on the sheet are numbered #1, #2 ... from top to bottom, then left to right.)
C?#29  0.01uF 50V 0603  [CAPC1608X87X35LL15T15]
C?#30  0.01uF 50V 0603  [CAPC1608X87X35LL15T15]
C?#31  0.01uF 50V 0603  [CAPC1608X87X35LL15T15]
C?#32  2.2uF 10V 0603  [FP-GRM188-0_1-e0_2_0_5-MFG]
C?#33  0.01uF 50V 0603  [CAPC1608X87X35LL15T15]
C?#34  470pF 50V 0603  [FP-C0603C-CF-MFG]
C?#35  470pF 50V 0603  [FP-C0603C-CF-MFG]
C?#36  470pF 50V 0603  [FP-C0603C-CF-MFG]
C?#37  0.01uF 50V 0603  [CAPC1608X87X35LL15T15]
C?#38  0.01uF 50V 0603  [CAPC1608X87X35LL15T15]
C?#39  0.01uF 50V 0603  [CAPC1608X87X35LL15T15]
C?#40  0.01uF 50V 0603  [CAPC1608X87X35LL15T15]
C?#41  0.01uF 50V 0603  [CAPC1608X87X35LL15T15]
C?#42  0.1uF 50V 0603  [FP-C0603C-CF-MFG]
C?#43  0.1uF 50V 0603  [FP-C0603C-CF-MFG]
C?#44  0.1uF 50V 0603  [FP-C0603C-CF-MFG]
C?#45  0.1uF 50V 0603  [FP-C0603C-CF-MFG]
J?  AREF Select  [WURTH_61300311121]
R?#44  49K9 1% 0603  [RESC1609X55X30ML10T20]
R?#45  10R2 1% 0603  [RESC1608X55X30ML15T15]
R?#46  4K99 1% 0603  [RESC1608X55X30NL20T20]
R?#47  10R2 1% 0603  [RESC1608X55X30ML15T15]
R?#48  4K99 1% 0603  [RESC1608X55X30NL20T20]
R?#49  330R 1% 0603  [RESC1608X55X25NL10T15]
R?#50  49K9 1% 0603  [RESC1609X55X30ML10T20]
R?#51  330R 1% 0603  [RESC1608X55X25NL10T15]
R?#52  49K9 1% 0603  [RESC1609X55X30ML10T20]
R?#53  330R 1% 0603  [RESC1608X55X25NL10T15]
R?#54  10R2 1% 0603  [RESC1608X55X30ML15T15]
R?#55  4K99 1% 0603  [RESC1608X55X30NL20T20]
R?#56  10R2 1% 0603  [RESC1608X55X30ML15T15]
R?#57  4K99 1% 0603  [RESC1608X55X30NL20T20]
R?#58  49K9 1% 0603  [RESC1609X55X30ML10T20]
R?#59  49K9 1% 0603  [RESC1609X55X30ML10T20]
R?#60  10R2 1% 0603  [RESC1608X55X30ML15T15]
R?#61  4K99 1% 0603  [RESC1608X55X30NL20T20]
R?#62  10R2 1% 0603  [RESC1608X55X30ML15T15]
R?#63  4K99 1% 0603  [RESC1608X55X30NL20T20]
R?#64  97K6 1% 0603  [RESC1608X55X30NL15T15]
R?#65  97K6 1% 0603  [RESC1608X55X30NL15T15]
R?#66  97K6 1% 0603  [RESC1608X55X30NL15T15]
R?#67  97K6 1% 0603  [RESC1608X55X30NL15T15]
R?#68  49K9 1% 0603  [RESC1609X55X30ML10T20]
R?#69  3K01 1% 0603  [RESC1608X55X30LL15T15]
R?#70  3K01 1% 0603  [RESC1608X55X30LL15T15]
R?#71  3K01 1% 0603  [RESC1608X55X30LL15T15]
R?#72  3K01 1% 0603  [RESC1608X55X30LL15T15]
R?#73  100K 1% 0603  [RESC1608X55X30ML20T20]
R?#74  100K 1% 0603  [RESC1608X55X30ML20T20]
SH-J?  SNT-100-BK-G  [SNT-100-BK-G]  (value not drawn)
U?#4  TLV9004IPWR  [FP-PW0014A-IPC_B]  (part A of 4)
U?#5  TLV9004IPWR  [FP-PW0014A-IPC_B]  (part B of 4)
U?#6  TLV9004IPWR  [FP-PW0014A-IPC_B]  (part C of 4)
U?#7  TLV9004IPWR  [FP-PW0014A-IPC_B]  (part D of 4)

### Blocks framed on the sheet
CSA Filters: C?#34-C?#36 R?#49 R?#51 R?#53
Sense Feedback Networks: C?#42-C?#45 R?#64-R?#67 R?#69-R?#72

### Ports
SNA (in), SNB (in), SNC (in), SPA (in), SPB (in), SPC (in)

### Nets
+3V3: C?#32.1 R?#73.2 U?#4.4(V+)
GND: C?#29.2 C?#31.2 C?#32.2 C?#33.2 C?#34.2 C?#35.2 C?#36.2 C?#38.1 C?#39.2 C?#41.1 C?#42.2 C?#43.2 C?#44.2 C?#45.2 J?.3 R?#69.1 R?#70.1 R?#71.1 R?#72.1 R?#74.1 U?#4.11(V-)
GVDD: R?#64.2
ISENA: C?#36.1 R?#49.2
ISENB: C?#35.1 R?#51.2
ISENC: C?#34.1 R?#53.2
SEN_GVDD: C?#42.1 R?#64.1 R?#69.2
SHA: R?#65.2
SHB: R?#66.2
SHC: R?#67.2
SNA: C?#29.1 R?#45.1 ; port SNA
SNB: C?#33.1 R?#54.1 ; port SNB
SNC: C?#39.1 R?#60.1 ; port SNC
SOA: R?#44.2 R?#49.1 U?#4.1(OUT1)
SOB: R?#51.1 R?#52.2 U?#5.7(OUT2)
SOC: R?#53.1 R?#59.2 U?#6.8(OUT3)
SPA: C?#31.1 R?#47.1 ; port SPA
SPB: C?#38.2 R?#56.1 ; port SPB
SPC: C?#41.2 R?#62.1 ; port SPC
VSENA: C?#43.1 R?#65.1 R?#70.2
VSENB: C?#44.1 R?#66.1 R?#71.2
VSENC: C?#45.1 R?#67.1 R?#72.2
NetC?#30_1: C?#30.1 R?#47.2 R?#48.1
NetC?#30_2: C?#30.2 R?#45.2 R?#46.1
NetC?#37_1: C?#37.1 R?#56.2 R?#57.1
NetC?#37_2: C?#37.2 R?#54.2 R?#55.1
NetC?#40_1: C?#40.1 R?#62.2 R?#63.1
NetC?#40_2: C?#40.2 R?#60.2 R?#61.1
NetJ?_1: J?.1 U?#7.13(IN4-) U?#7.14(OUT4)
NetJ?_2: J?.2 R?#50.1 R?#58.1 R?#68.1
NetR?#44_1: R?#44.1 R?#46.2 U?#4.2(IN1-)
NetR?#48_2: R?#48.2 R?#50.2 U?#4.3(IN1+)
NetR?#52_1: R?#52.1 R?#55.2 U?#5.6(IN2-)
NetR?#57_2: R?#57.2 R?#58.2 U?#5.5(IN2+)
NetR?#59_1: R?#59.1 R?#61.2 U?#6.9(IN3-)
NetR?#63_2: R?#63.2 R?#68.2 U?#6.10(IN3+)
NetR?#73_1: R?#73.1 R?#74.2 U?#7.12(IN4+)

### Notes on the sheet
- MOTOR DRIVER | DRV8300 | 100V MAX @ 25A
- MCU FEEDBACK SCHEMATIC
- ESP32-DCU-Rev1 | DC MOTOR CONTROL
- PAGE 1 / 1
- 7
- Rev 1.0
- D. Gusev
- (in symbol CMP-04895-000296-1, part A) -; +
- (in symbol CMP-04895-000296-1, part B) -; +
- (in symbol CMP-04895-000296-1, part C) -; +
- (in symbol CMP-04895-000296-1, part D) -; +

### Library data of the parts
C?#29-C?#31 C?#33 C?#37-C?#41 = CMP-2006-03299-1: Manufacturer: Kemet; Part Number: C0603X103K5RACTU
C?#32 = CMP-2006-02836-2: Chip Multilayer Ceramic Capacitors for General Purpose, 0603, 2.2uF, X7R, 15%, 10%, 10V; Case Code (Metric): 1608; Height: 0.8mm; Packaging: Cut Tape; Voltage: 10V; Lead Free: Lead Free; Min Operating Temperature: -55°C; Voltage Rating (DC): 10V; Max Operating Temperature: 125°C; Voltage Rating: 10V; Dielectric: X7R; Depth: 0.8mm; Case Code (Imperial): 0603; Termination: SMD/SMT; Case/Package: 0603; Number of Pins: 2; REACH SVHC: No SVHC; Mount: Surface Mount; Width: 0.031inch; Material: Ceramic; Capacitance: 2.2uF; Package Quantity: 1; Weight: 7.1E-05oz; Length: 1.6mm; Thickness: 0.035inch; Tolerance: 10%
C?#34-C?#36 = CMP-2006-03816-2: CAP CER 470PF 50V X7R 0603; Manufacturer Part Number: C0603C471K5RACTU; Manufacturer: KEMET; Tolerance: 0.1; Temperature Coefficient: 30ppm/°C; Material: Ceramic; Automotive Grade: Grade 1; Description: C0603 470 pF X7R 30ppm/°C 10.00% 50 V; Capacitance: 470 pF; Temperature Characteristic: X7R; Mouser Description: Ceramic Capacitor, 470Pf, 50V, X7R, 10%, 0603, Full Reel; Height: 0.87mm; Temperature: -55°C to +125°C; RoHS: TRUE; Lead Free: Yes; Category: Cap; ComponentLink2URL: https://api.kemet.com/component-edge/download/datasheet/C0603C100J5GACAUTO.pdf; Device Class L3: Ceramic Capacitors; Temperature Range High: +125°C; Package: C0603C-CF; Automotive: Yes; Device Class L2: Capacitors; Device Class L1: Passive Components; Value: 470 pF; Digikey Description: CAP CER 470PF 50V X7R 0603; Temperature Range Low: -55°C; ComponentLink2Description: Datasheet; Voltage Rating: 50 V; Octopart: https://octopart.com/c0603c471k5ractu-kemet-89311
C?#42-C?#45 = CMP-2006-03061-2: as C?#18 on sheet DRV8300_GATES; Temperature: -55°C to +125°C; RoHS: TRUE; Temperature Range High: +125°C; Lead Free: Yes; Octopart: https://octopart.com/c0603c104k5ractu-kemet-139244; Digikey Description: CAP CER 0.1UF 50V X7R 0603; Category: Cap; Package: C0603C-CF; ComponentLink2Description: Datasheet; Temperature Range Low: -55°C; Device Class L1: Passive Components; Voltage Rating: 50 V; Automotive: Yes; Device Class L3: Ceramic Capacitors; ComponentLink2URL: https://api.kemet.com/component-edge/download/datasheet/C0603C100J5GACAUTO.pdf; Capacitance: 0.10 μF; Device Class L2: Capacitors; Temperature Characteristic: X7R; Height: 0.87mm
J? = CMP-0054796-2: Header, 2.54 mm, 3x1, Gold, TH; Manufacturer: Wurth Elektronik; PartNumber: 61300311121; Green_Lifecycle: Active; Green_REACh: Passed; Cert_UL: Y; Gender: Male; Pitch_mm: 2.54; Row_Count: 1; Shrouded: N; ComponentLink1URL: http://katalog.we-online.de/em/datasheet/6130xx11121.pdf; ClassName: Header; Supplier Part Number 2: 20X0950; Supplier 2: Newark; Supplier Part Number 3: 356154; Supplier 3: Farnell; RoHS: Y; MountType: TH; Green_EU RoHS-2: Incomplete; Supplier 1: Digi-Key; Green_EU RoHS: Passed; PackageReference: Header, 2.54mm, 3x1, TH; CompType: Header; ComponentLink1Description: Datasheet URL; Supplier Part Number 1: 732-5316-ND; Color: Black; ContactFinish: Gold; Orientation: Vertical; PinCount: 3
R?#44 R?#50 R?#52 R?#58 R?#59 R?#68 = CMP-2000-03772-1: Part Number: TNPW060349K9BEEA; Manufacturer: Vishay Dale
R?#45 R?#47 R?#54 R?#56 R?#60 R?#62 = CMP-2000-00196-1: Manufacturer: Panasonic; Part Number: ERJ-3EKF10R2V
R?#46 R?#48 R?#55 R?#57 R?#61 R?#63 = CMP-2000-00077-1: Manufacturer: Panasonic; Part Number: ERA3AEB4991V
R?#49 R?#51 R?#53 = CMP-1659-00020-2: Chip Resistor, 330 Ohm, +/- 1%, 0.1 W, -55 to 155 degC, 0603 (1608 Metric), RoHS, Tape and Reel; Tolerance: 10%; ESR: 800 mohm; Voltage Rating (DC): 16 V; Capacitance: 47 uF; Length: 7.3 mm; ComponentLink1URL: http://www.yageo.com/; Packaging: Tape and Reel; Pins: 2; ComponentLink1Description: Manufacturer URL; Case Code (Imperial): 2917; REACH SVHC: No SVHC; Width: 4.3 mm; ComponentLink2Description: Datasheet; Voltage Rating: 16 V; RoHSCompliant: True; Max Operating Temperature: 125degC; ComponentLink2URL: http://www.yageo.com/documents/recent/PYu-RC_Group_51_RoHS_L_04.pdf; Min Operating Temperature: -55degC; Case/Package: 2917; Radiation Hardening: No; DatasheetVersion: Rev. 4, 02/2016; Mount: Surface Mount; PackageReference: 0603; Package Quantity: 500; Case Code (Metric): 7343; PackageDescription: 2-Pin Surface Mount Device, Body 1.6 x 0.8 mm; Height: 3.1 mm
R?#64-R?#67 = CMP-2000-00697-1: Manufacturer: Panasonic; Part Number: ERJ-3EKF9762V
R?#69-R?#72 = CMP-2000-00416-1: Part Number: ERJ-3EKF3011V; Manufacturer: Panasonic
R?#73 R?#74 = CMP-2000-00875-1: Part Number: ERA3AEB104V; Manufacturer: Panasonic
SH-J? = CMP-0003623-3: Shunt, 100mil, Gold plated, Black; Alternate PartNumber: 969102-0000-DA; Manufacturer: Samtec; Alternate Manufacturer: 3M; Value: 1x2; ComponentLink1URL: http://www.samtec.com/ftppub/pdf/SNT.PDF; Supplier 1: Digi-Key; CompType: Shunt; PackageReference: Shunt; ClassName: Shunt; RoHS: Y; Supplier Part Number 1: SAM8858-ND; MountType: N/A; PartNumber: SNT-100-BK-G; ComponentLink1Description: Datasheet Link
U?#4-U?#7 = CMP-04895-000296-1: IC CMOS 4 CIRCUIT 14TSSOP; Operating Supply Current: 60uA; Slew Rate: 2V/µs; Input Offset Voltage (Vos): 400uV; Output Current per Channel: 40mA; Number of Channels: 4; Gain Bandwidth Product: 1MHz; Input Bias Current: 5pA; Number of Pins: 14; Min Operating Temperature: -40°C; RoHS Compliant: Yes; Case/Package: TSSOP; Mount: Surface Mount; Max Operating Temperature: 125°C; Packaging: Tape and Reel; Number of Circuits: 4